# Altium project High_Current_H_Bridge.PrjPCB
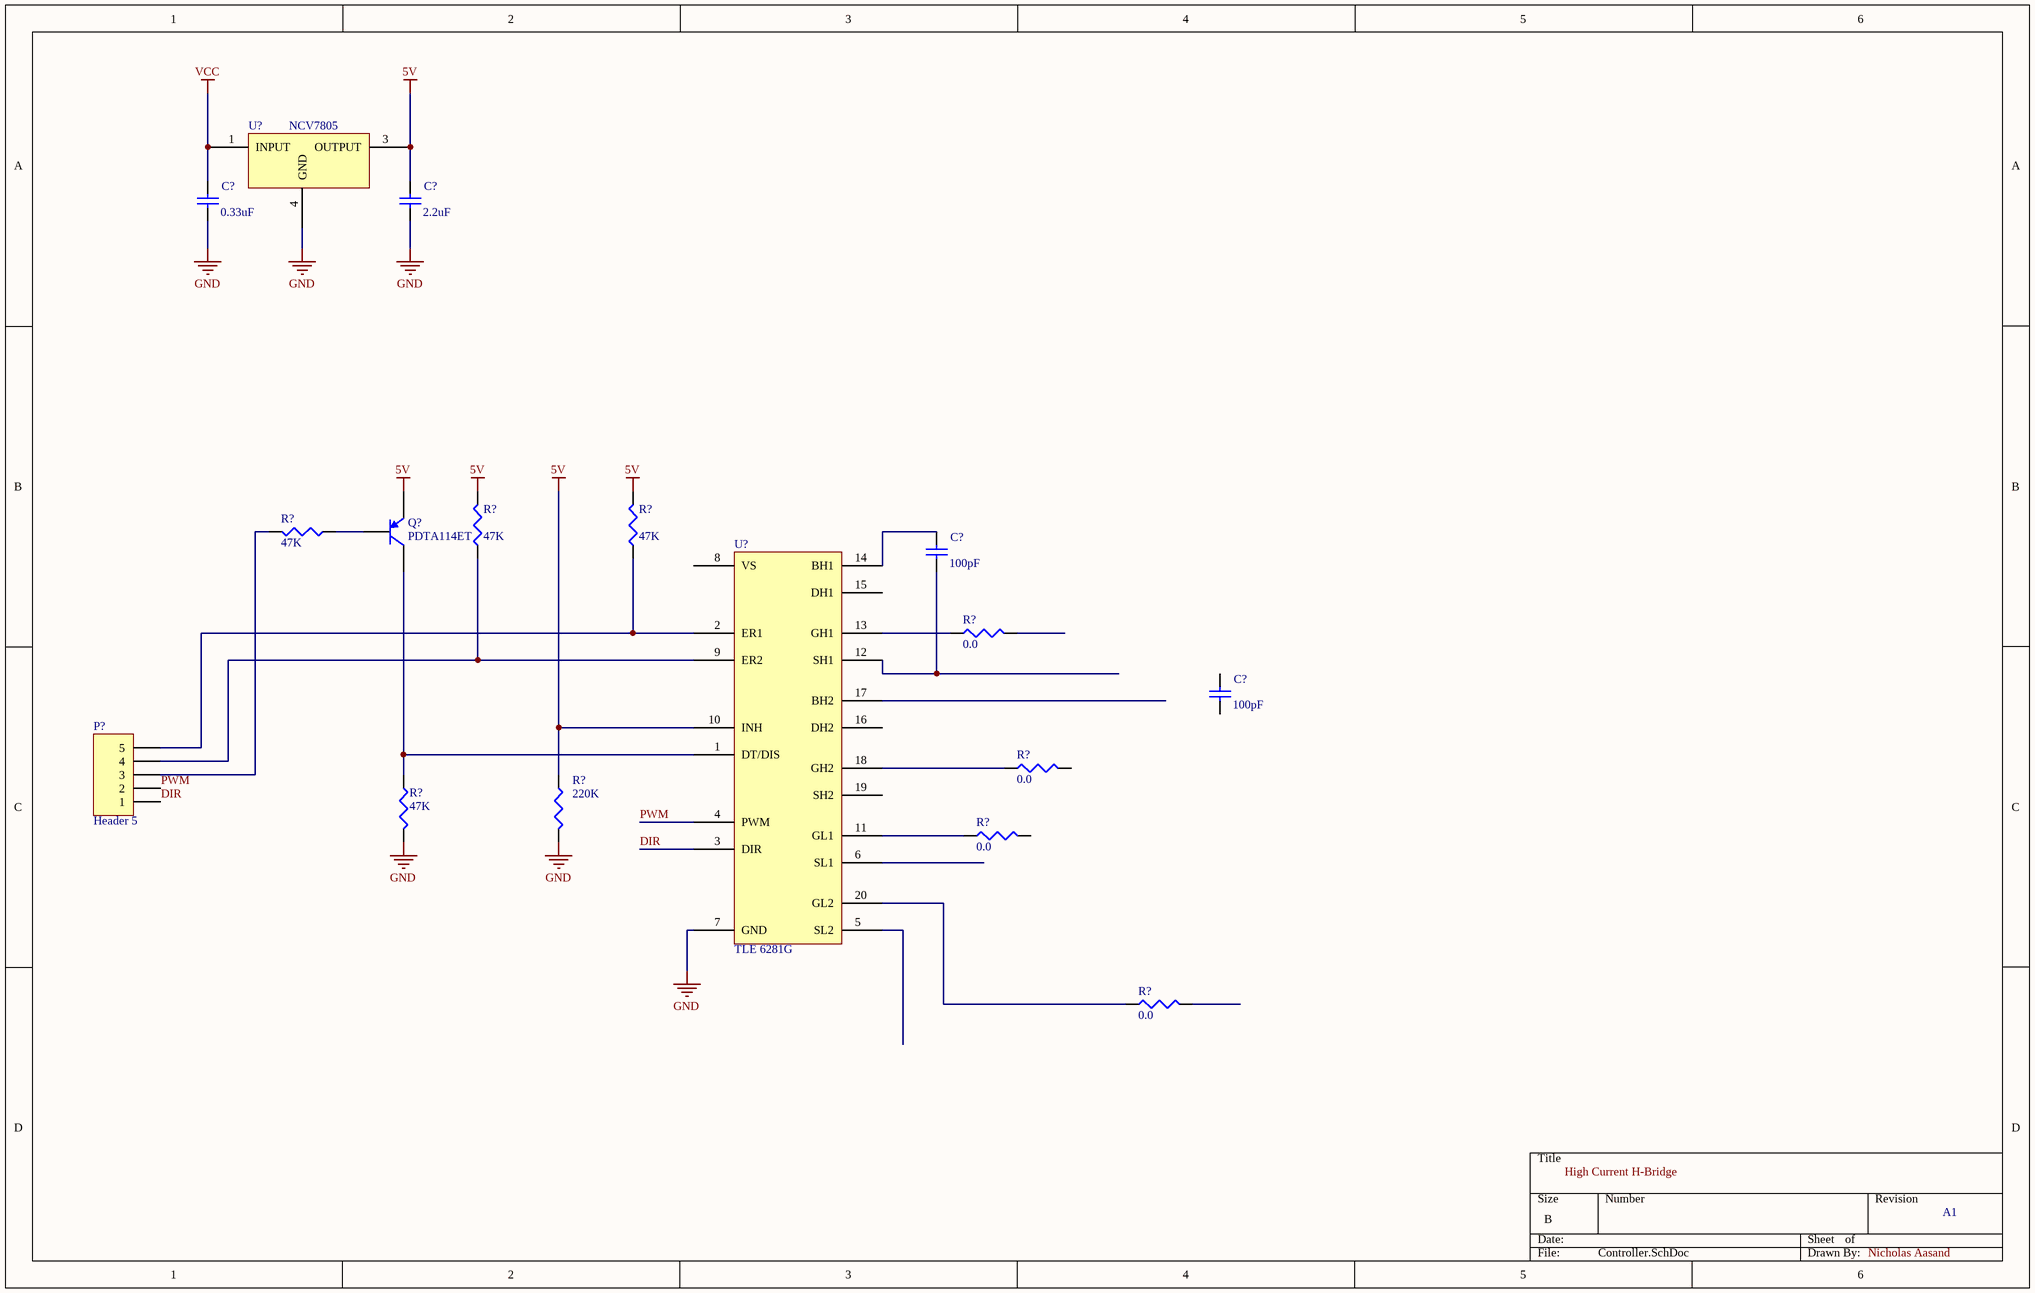
[diagram p0: Controller.SchDoc]
1 sheet, 17 parts. Net scope: global (net labels, ports and power ports of the same name join across sheets).

## Sheet Controller.SchDoc
size B

### Parts
(Parts that share a designator on the sheet are numbered #1, #2 ... from top to bottom, then left to right.)
C?#1  value 0.33uF  [C0805]  (hidden comment: 0805)
C?#2  value 2.2uF  [C0805]  (hidden comment: 0805)
C?#3  value 100pF  [C0805]  (hidden comment: 0805)
C?#4  value 100pF  [C0805]  (hidden comment: 0805)
P?  Header 5  [HDR1X5]
Q?  PDTA114ET  [SOT23_N]
R?#1  value 47K  [6-0805_N]  (hidden comment: 0805)
R?#2  value 47K  [6-0805_N]  (hidden comment: 0805)
R?#3  value 47K  [6-0805_N]  (hidden comment: 0805)
R?#4  value 0.0  [C1206]  (hidden comment: 1206)
R?#5  value 0.0  [C1206]  (hidden comment: 1206)
R?#6  value 47K  [6-0805_N]  (hidden comment: 0805)
R?#7  value 220K  [6-0805_N]  (hidden comment: 0805)
R?#8  value 0.0  [C1206]  (hidden comment: 1206)
R?#9  value 0.0  [C1206]  (hidden comment: 1206)
U?#1  NCV7805  [DPAK-3]
U?#2  TLE 6281G

### Nets
5V: C?#2.2 Q?.1(E) R?#2.2 R?#3.2 R?#7.1 U?#1.3(OUTPUT) U?#2.10(INH)
GND: C?#1.1 C?#2.1 R?#6.2 R?#7.2 U?#1.4(GND) U?#2.7(GND)
VCC: C?#1.2 U?#1.1(INPUT)
DIR: P?.1 U?#2.3(DIR)
PWM: P?.2 U?#2.4(PWM)
NetC?#3_1: C?#3.1 U?#2.12(SH1)
NetC?#3_2: C?#3.2 U?#2.14(BH1)
NetP?_3: P?.3 R?#1.2
NetP?_4: P?.4 R?#2.1 U?#2.9(ER2)
NetP?_5: P?.5 R?#3.1 U?#2.2(ER1)
NetQ?_2: Q?.2(B) R?#1.1
NetQ?_3: Q?.3(C) R?#6.1 U?#2.1(DT/DIS)
NetR?#4_1: R?#4.1 U?#2.13(GH1)
NetR?#5_1: R?#5.1 U?#2.18(GH2)
NetR?#8_1: R?#8.1 U?#2.11(GL1)
NetR?#9_1: R?#9.1 U?#2.20(GL2)

Not connected (* = marked no-connect by the designer): C?#4 1 2; R?#4 2; R?#5 2; R?#8 2; R?#9 2; U?#1 2(NC); U?#2 5(SL2) 6(SL1) 8(VS) 15(DH1) 16(DH2) 17(BH2) 19(SH2)

### Notes on the sheet
- High Current H-Bridge
- A1
- Nicholas Aasand

### Library data of the parts
C?#1-C?#4 = Cap Semi: Capacitor (Semiconductor SIM Model); Published: 8-Jun-2000; LatestRevisionDate: 29-May-2009; LatestRevisionNote: IPC-7351 Footprint Added.; PackageReference: C1206; Publisher: Altium Limited; PackageDescription: Chip Capacitor
  C?#1: Digikey: 1276-2958-1-ND
  C?#2: Digikey: 445-12734-1-ND
  C?#3 C?#4: Digikey: 1276-2569-1-ND
P? = Header 5: Header, 5-Pin; LatestRevisionDate: 17-Jul-2002; LatestRevisionNote: Re-released for DXP Platform.; Publisher: Altium Limited
Q? = 2N3906: PNP resistor-epquipped transistor, 10k/10k; LatestRevisionDate: 15-Jan-2003; LatestRevisionNote: PCB Footprint 'BCY-W3/D4.7' replaced; DatasheetVersion: 1997; PackageReference: TO-92A; Publisher: Altium Limited; PackageDescription: TO, Flat Index; 3 In-Line, Axial Leads; Body Dia. 4.5mm; Leads 0.51 x 0.48 mm (max); ComponentLink1Description: Manufacturer Link; ComponentLink1URL: http://www.fairchildsemi.com/; ComponentLink2Description: Datasheet; ComponentLink2URL: http://www.fairchildsemi.com/ds/2N%2F2N3906.pdf
R?#1-R?#9 = Res3: Resistor
  R?#1-R?#3 R?#6: Digikey: 311-47.0KCRCT-ND
  R?#4 R?#5 R?#8 R?#9: Digikey: 311-0.0LICT-ND
  R?#7: Published: 8-Jun-2000; LatestRevisionDate: 29-May-2009; LatestRevisionNote: IPC-7351 Footprint Added.; PackageReference: J1-0603; Publisher: Altium Limited; PackageDescription: Chip Resistor; Digikey: 311-220KARCT-ND
U?#1 = NCV7805: ON Semiconductor 5V LDO VREG, 1A, 35V
U?#2 = TLE 6281G: Infineon H-Bridge Driver IC, 7.5-60V, 850/580mA On/Off Current